# Altium schematic sheet Connector_Block.SchDoc
size A4; CheckedBy: CT-Energys; Author: CT-Energys; CompanyName: HTD COMPANY LIMITED; DrawnBy: CHITOAN; Engineer: CHITOAN; Organization: Altium Limited; Address1: HO CHI MINH CITY; Address2: VIETNAM
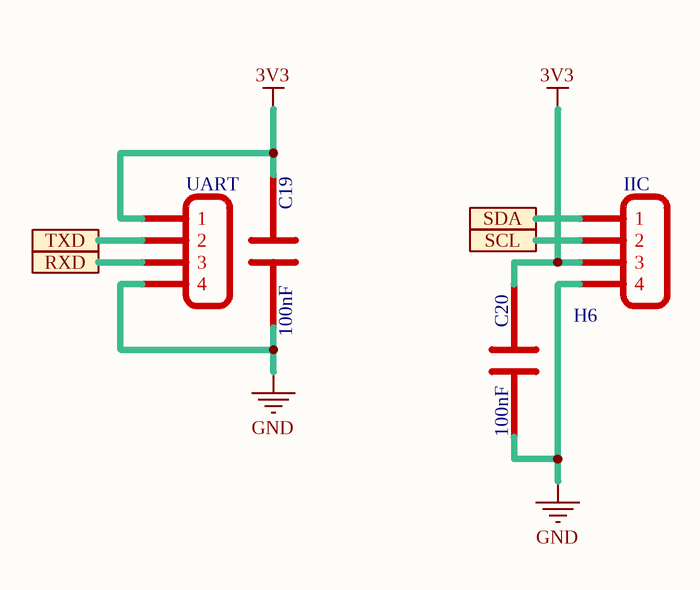
[diagram p0: Connector_Block.SchDoc]

## Parts
C19  100nF  [C0805]
C20  100nF  [C0805]
H5  UART  [XH-2.54-4P]
H6  IIC  [XH-2.54-4P]

## Ports
RXD, SCL, SDA, TXD

## Nets
3V3: C19.2 C20.2 H5.1 H6.3
GND: C19.1 C20.1 H5.4 H6.4
RXD: H5.3 ; port RXD
SCL: H6.2 ; port SCL
SDA: H6.1 ; port SDA
TXD: H5.2 ; port TXD

## Notes on the sheet
- Title
- Size:
- Date:
- A4
- Number:
- Time:
- Revision:
- Design by:
- Company:
- File:

## Library data of the parts
C19 C20 = CAP-CER: Ceramic Capacitor
H5 H6 = CONN-4P: Connector 4 Pole